# EAGLE design ENGI301 (EAGLE 9.7.0)
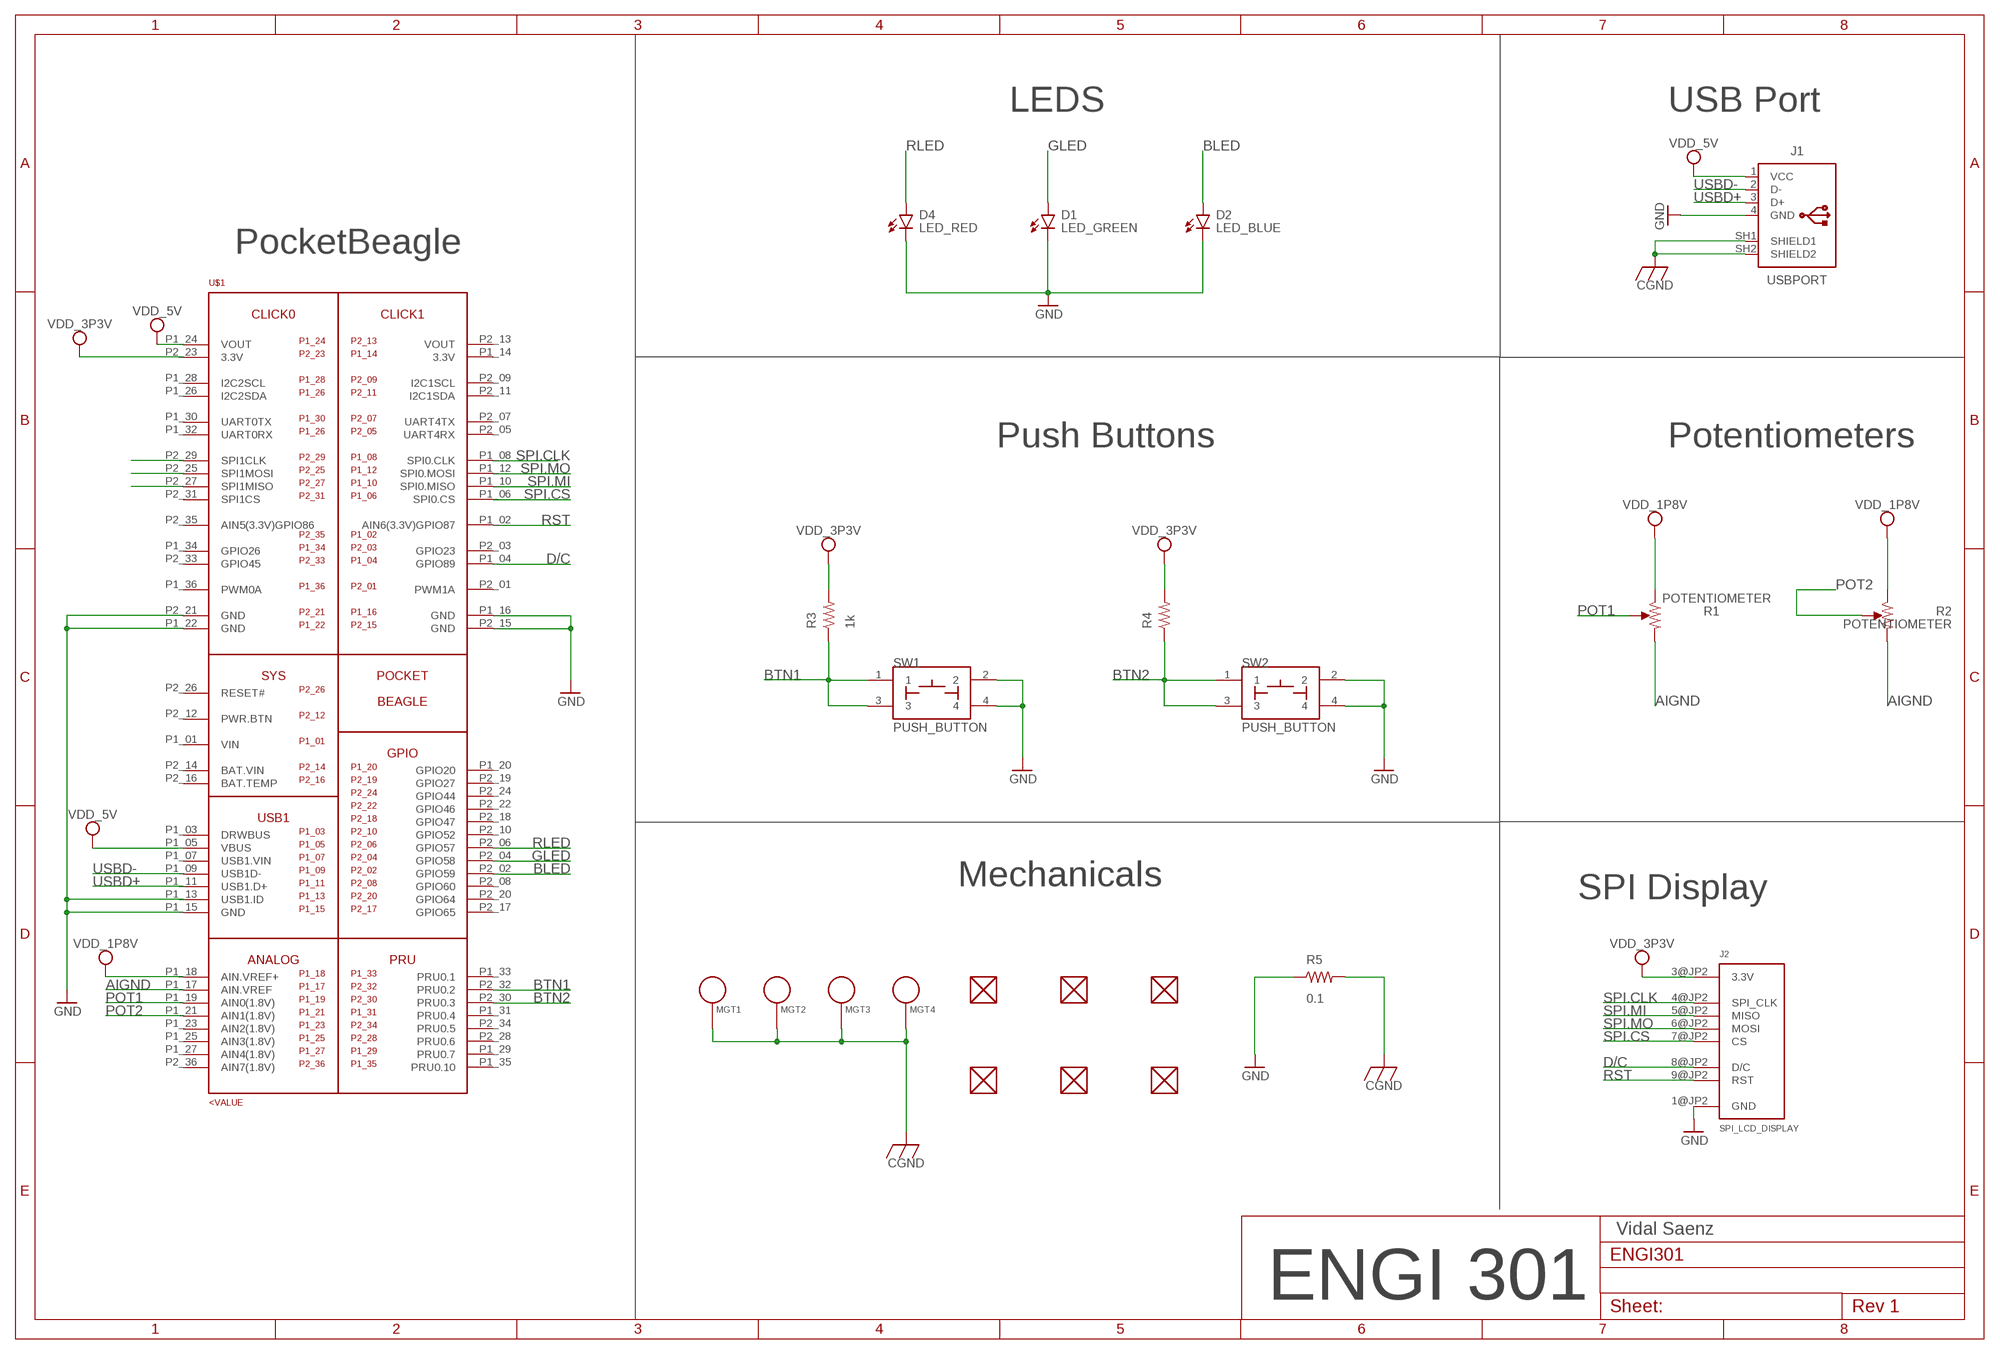
[diagram p0: schematic, sheet 1]

## Parts
D1  LED_GREEN  LED_G_1206  [LEDC3216X75N_FLAT-G]
D2  LED_BLUE  LED_B_1206  [LEDC3216X75N_FLAT-B]
D4  LED_RED  LED_R_1206  [LEDC3216X75N_FLAT-R]
FUD1  FIDUCIAL  [FIDUCIAL_40MIL]
FUD2  FIDUCIAL  [FIDUCIAL_40MIL]
FUD3  FIDUCIAL  [FIDUCIAL_40MIL]
FUD4  FIDUCIAL  [FIDUCIAL_40MIL]
FUD5  FIDUCIAL  [FIDUCIAL_40MIL]
FUD6  FIDUCIAL  [FIDUCIAL_40MIL]
J1  USBPORT  [1734366]
J2  SPI_LCD_DISPLAY  [SPI_LCD_DISPLAY]
MGT1  MOUNTING_HOLE  [MOUNTING_HOLE]
MGT2  MOUNTING_HOLE  [MOUNTING_HOLE]
MGT3  MOUNTING_HOLE  [MOUNTING_HOLE]
MGT4  MOUNTING_HOLE  [MOUNTING_HOLE]
R1  POTENTIOMETER  [POT-PO90S]
R2  POTENTIOMETER  [POT-PO90S]
R3  1k  R_R1206  [R1206]
R4  R_R1206  [R1206]
R5  0.1  R_R0603  [R0603]
SW1  PUSH_BUTTON  [BUTTON_12.5MM]
SW2  PUSH_BUTTON  [BUTTON_12.5MM]
U$1  POCKETBEAGLE  [POCKETBEAGLE]

## Nets
AIGND: R1.CW R2.CW U$1.P1_17(AIN.VREF)
BLED: D2.A U$1.P2_02(GPIO59)
BTN1: R3.1 SW1.1 SW1.3 U$1.P2_32(PRU0.2)
BTN2: R4.1 SW2.1 SW2.3 U$1.P2_30(PRU0.3)
CGND: MGT1.P$1 MGT2.P$1 MGT3.P$1 MGT4.P$1 R5.2
D/C: J2.8@JP2(D/C) U$1.P1_04(GPIO89)
GLED: D1.A U$1.P2_04(GPIO58)
GND: J1.4(GND) J2.1@JP2(GND) R5.1 SW1.2 SW1.4 SW2.2 SW2.4 U$1.P1_13(USB1.ID) U$1.P1_15(GND) U$1.P1_16(GND) U$1.P1_22(GND) U$1.P2_15(GND) U$1.P2_21(GND)
N$1: D1.C D2.C D4.C ; supply symbol labelled GND
N$2: U$1.P2_29(SPI1CLK)
N$3: U$1.P2_25(SPI1MOSI)
N$4: U$1.P2_27(SPI1MISO)
POT1: R1.S U$1.P1_19(AIN0(1.8V))
POT2: R2.S U$1.P1_21(AIN1(1.8V))
RLED: D4.A U$1.P2_06(GPIO57)
RST: J2.9@JP2(RST) U$1.P1_02(AIN6(3.3V)GPIO87)
SHIELD2: J1.SH1(SHIELD1) J1.SH2(SHIELD2) ; supply symbol labelled CGND
SPI.CLK: J2.4@JP2(SPI_CLK) U$1.P1_08(SPI0.CLK)
SPI.CS: J2.7@JP2(CS) U$1.P1_06(SPI0.CS)
SPI.MI: J2.5@JP2(MISO) U$1.P1_10(SPI0.MISO)
SPI.MO: J2.6@JP2(MOSI) U$1.P1_12(SPI0.MOSI)
USBD+: J1.3(D+) U$1.P1_11(USB1.D+)
USBD-: J1.2(D-) U$1.P1_09(USB1D-)
VDD_1P8V: R1.CCW R2.CCW U$1.P1_18(AIN.VREF+)
VDD_3P3V: J2.3@JP2(3.3V) R3.2 R4.2 U$1.P2_23(3.3V)
VDD_5V: J1.1(VCC) U$1.P1_05(VBUS) U$1.P1_24(VOUT)
Unconnected: FUD1.P$1 FUD2.P$1 FUD3.P$1 FUD4.P$1 FUD5.P$1 FUD6.P$1 U$1.P1_01(VIN) U$1.P1_03(DRWBUS) U$1.P1_07(USB1.VIN) U$1.P1_14(3.3V) U$1.P1_20(GPIO20) U$1.P1_23(AIN2(1.8V)) U$1.P1_25(AIN3(1.8V)) U$1.P1_26(I2C2SDA) U$1.P1_27(AIN4(1.8V)) U$1.P1_28(I2C2SCL) U$1.P1_29(PRU0.7) U$1.P1_30(UART0TX) U$1.P1_31(PRU0.4) U$1.P1_32(UART0RX) U$1.P1_33(PRU0.1) U$1.P1_34(GPIO26) U$1.P1_35(PRU0.10) U$1.P1_36(PWM0A) U$1.P2_01(PWM1A) U$1.P2_03(GPIO23) U$1.P2_05(UART4RX) U$1.P2_07(UART4TX) U$1.P2_08(GPIO60) U$1.P2_09(I2C1SCL) U$1.P2_10(GPIO52) U$1.P2_11(I2C1SDA) U$1.P2_12(PWR.BTN) U$1.P2_13(VOUT) U$1.P2_14(BAT.VIN) U$1.P2_16(BAT.TEMP) U$1.P2_17(GPIO65) U$1.P2_18(GPIO47) U$1.P2_19(GPIO27) U$1.P2_20(GPIO64) U$1.P2_22(GPIO46) U$1.P2_24(GPIO44) U$1.P2_26(RESET#) U$1.P2_28(PRU0.6) U$1.P2_31(SPI1CS) U$1.P2_33(GPIO45) U$1.P2_34(PRU0.5) U$1.P2_35(AIN5(3.3V)GPIO86) U$1.P2_36(AIN7(1.8V))

## Notes on the sheet
- LEDS | USB Port
- PocketBeagle
- Push Buttons | Potentiometers
- Mechanicals
- SPI Display
- Vidal Saenz
- ENGI 301

## Library data of the parts
D1 = ENGI301:LED_G; CATEGORY: LED; COLOR: GREEN; DESCRIPTION: CHIP LED FLAT; SUB-CATEGORY: CHIP; TYPE: FLAT_TOP
D2 = ENGI301:LED_B; CATEGORY: LED; COLOR: BLUE; DESCRIPTION: CHIP LED FLAT; SUB-CATEGORY: CHIP; TYPE: FLAT_TOP
D4 = ENGI301:LED_R; CATEGORY: LED; COLOR: RED; DESCRIPTION: CHIP LED FLAT; SUB-CATEGORY: CHIP; TYPE: FLAT_TOP
FUD1-FUD6 = Etch_a_Sketch:FIDUCIAL
J1 = ENGI301:USBPORT: USB(2.0) Type-A, RCPT, 4POS, THT-VERT Datasheet <https://www.te.com/commerce/DocumentDelivery/DDEController?Action=showdoc&DocId=Data+Sheet%7F7-1773442-0%7F0306%7Fpdf%7FEnglish%7FENG_DS_7-1773442-0_0306.pdf%7F1734366-1> Drawing <https://www.te.com/commerce/DocumentDelivery/DDEController?Action=srchrtrv&DocNm=1734366&DocType=Customer+Drawing&DocLang=English>; CATEGORY: Connector; CONTACTS: 4; CURRENT_RATING: 1A; DESCRIPTION: CONN RCPT USB2.0 TYPEA 4POS VERT; GENDER: Receptacle; MANUFACTURER: TE Connectivity; MOUNT_TYPE: Vertical; MPN: 1734366-1; OPERATING_TEMP: -40° to +80°C; PART_STATUS: Active; ROHS_COMPLIANT: RoHS Compliant; SERIES: -; SUB-CATEGORY: USB; TYPE: USB-A; VOLTAGE_RATING: 30VAC(rms)
J2 = ENGI301:SPI_LCD_DISPLAY: 2.8" Adafruit SPI Display
MGT1-MGT4 = Etch_a_Sketch:MOUNTING_HOLE: Chassis Mounting Hole w/GND connection ability
R1 R2 = ENGI301:POTENTIOMETER: Potentiometer - Examples: P090S-14T20BR10K (987-1277-ND)
R3-R5 = Etch_a_Sketch:R_: RESISTOR, American symbol
SW1 SW2 = ENGI301:PUSH_BUTTON
U$1 = ENGI301:POCKETBEAGLE

## Board
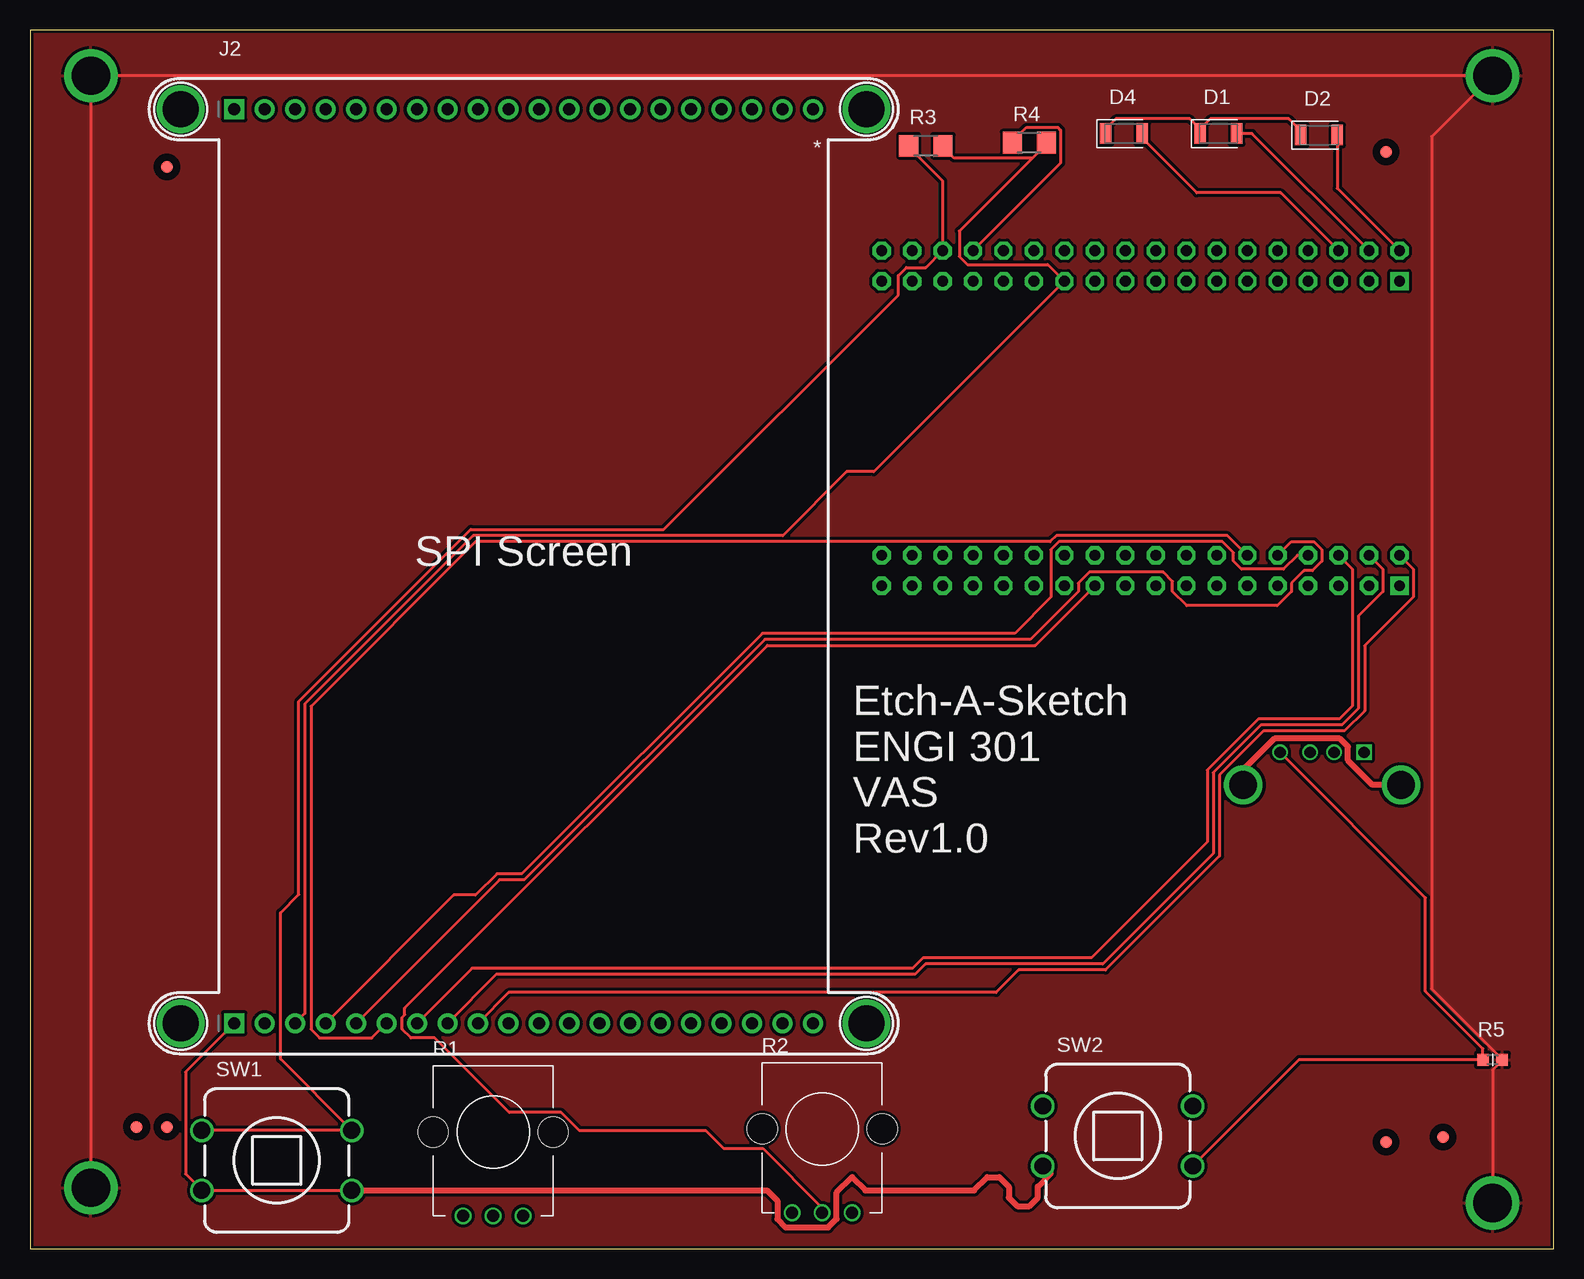
[diagram p1: board, top side]
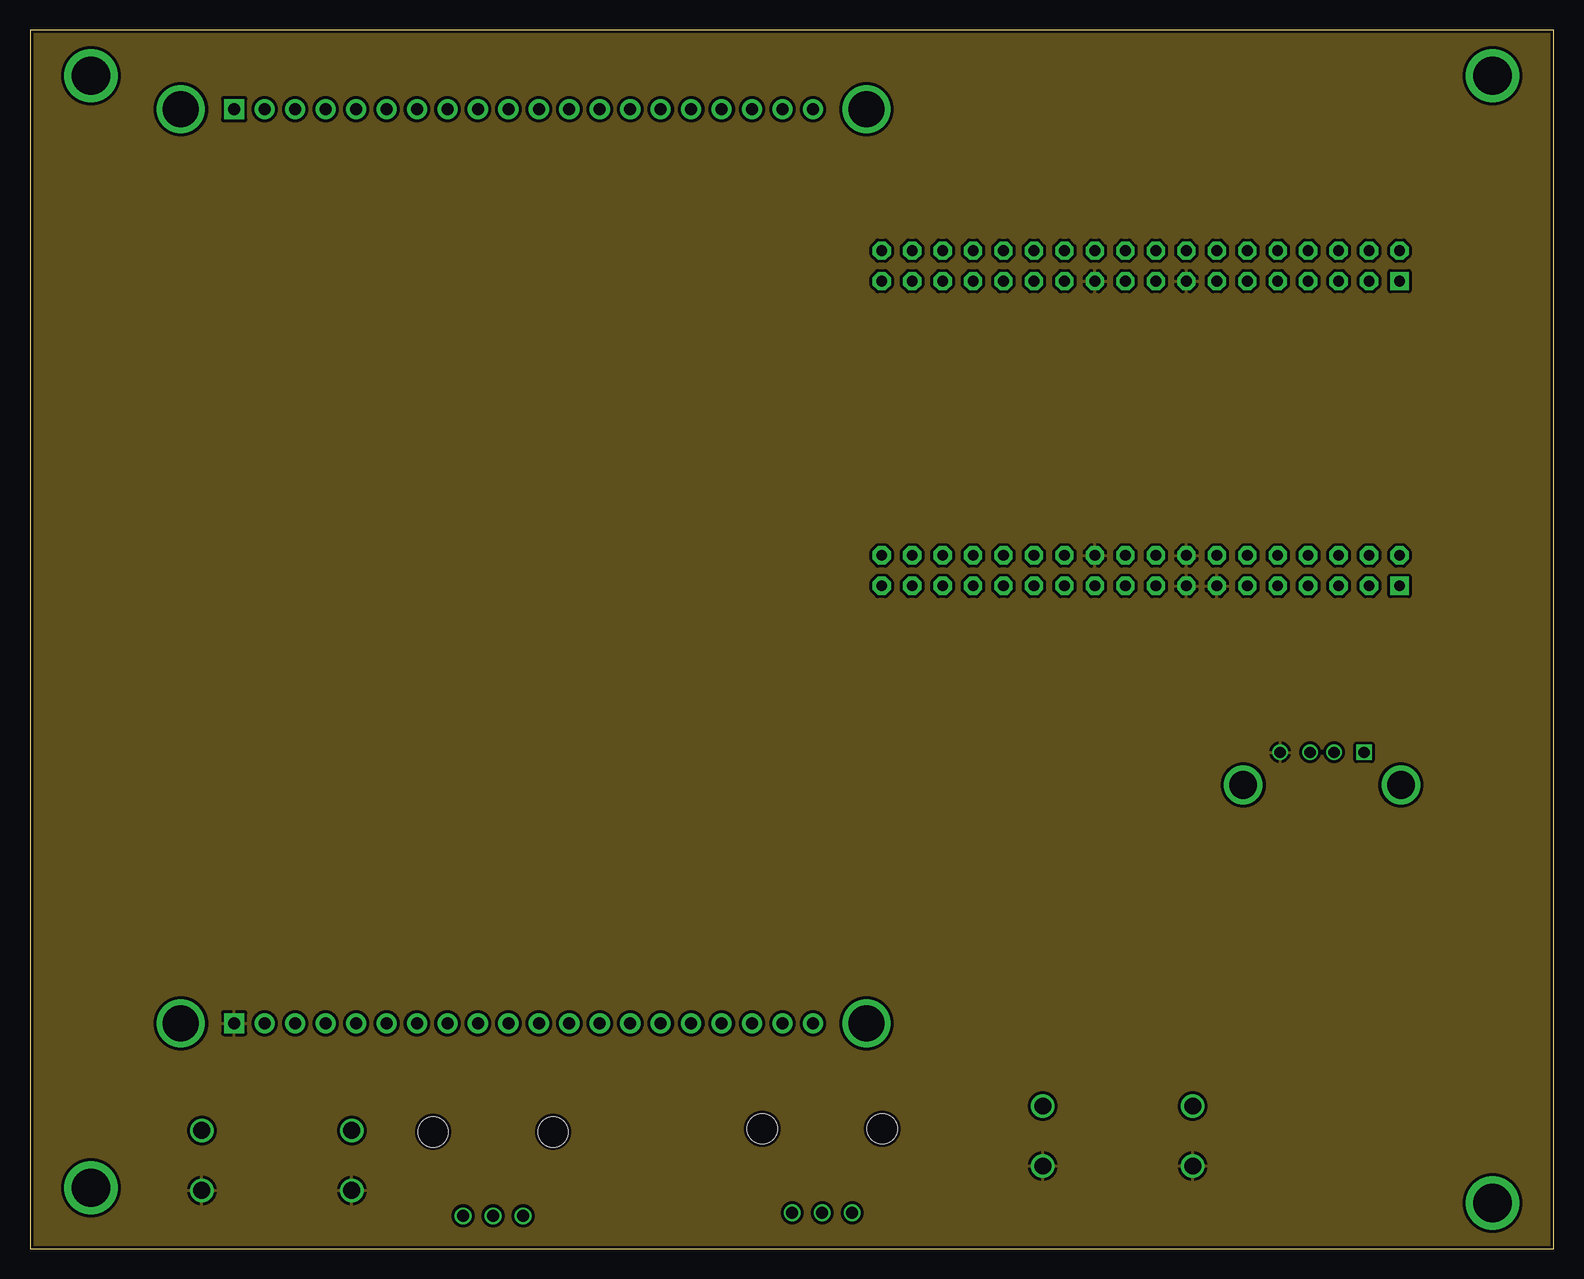
[diagram p2: board, inner layer Route2]
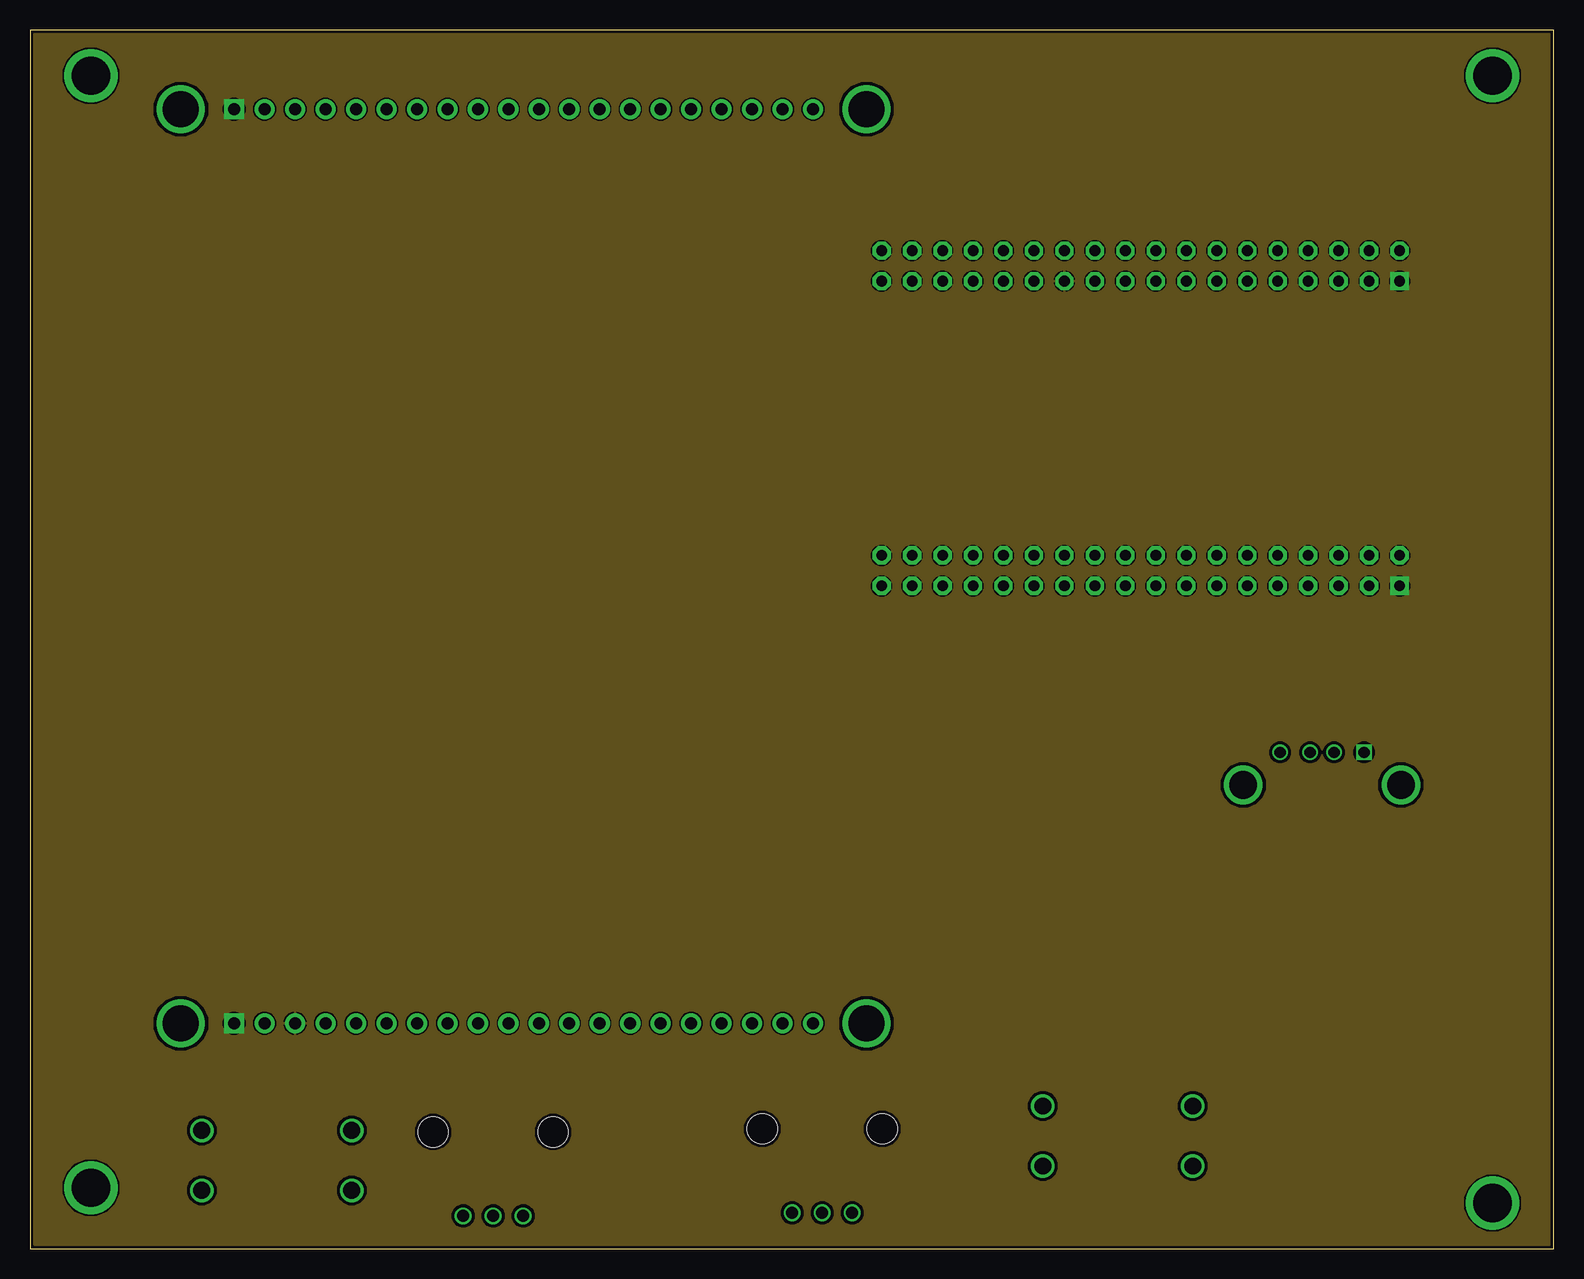
[diagram p3: board, inner layer Route15]
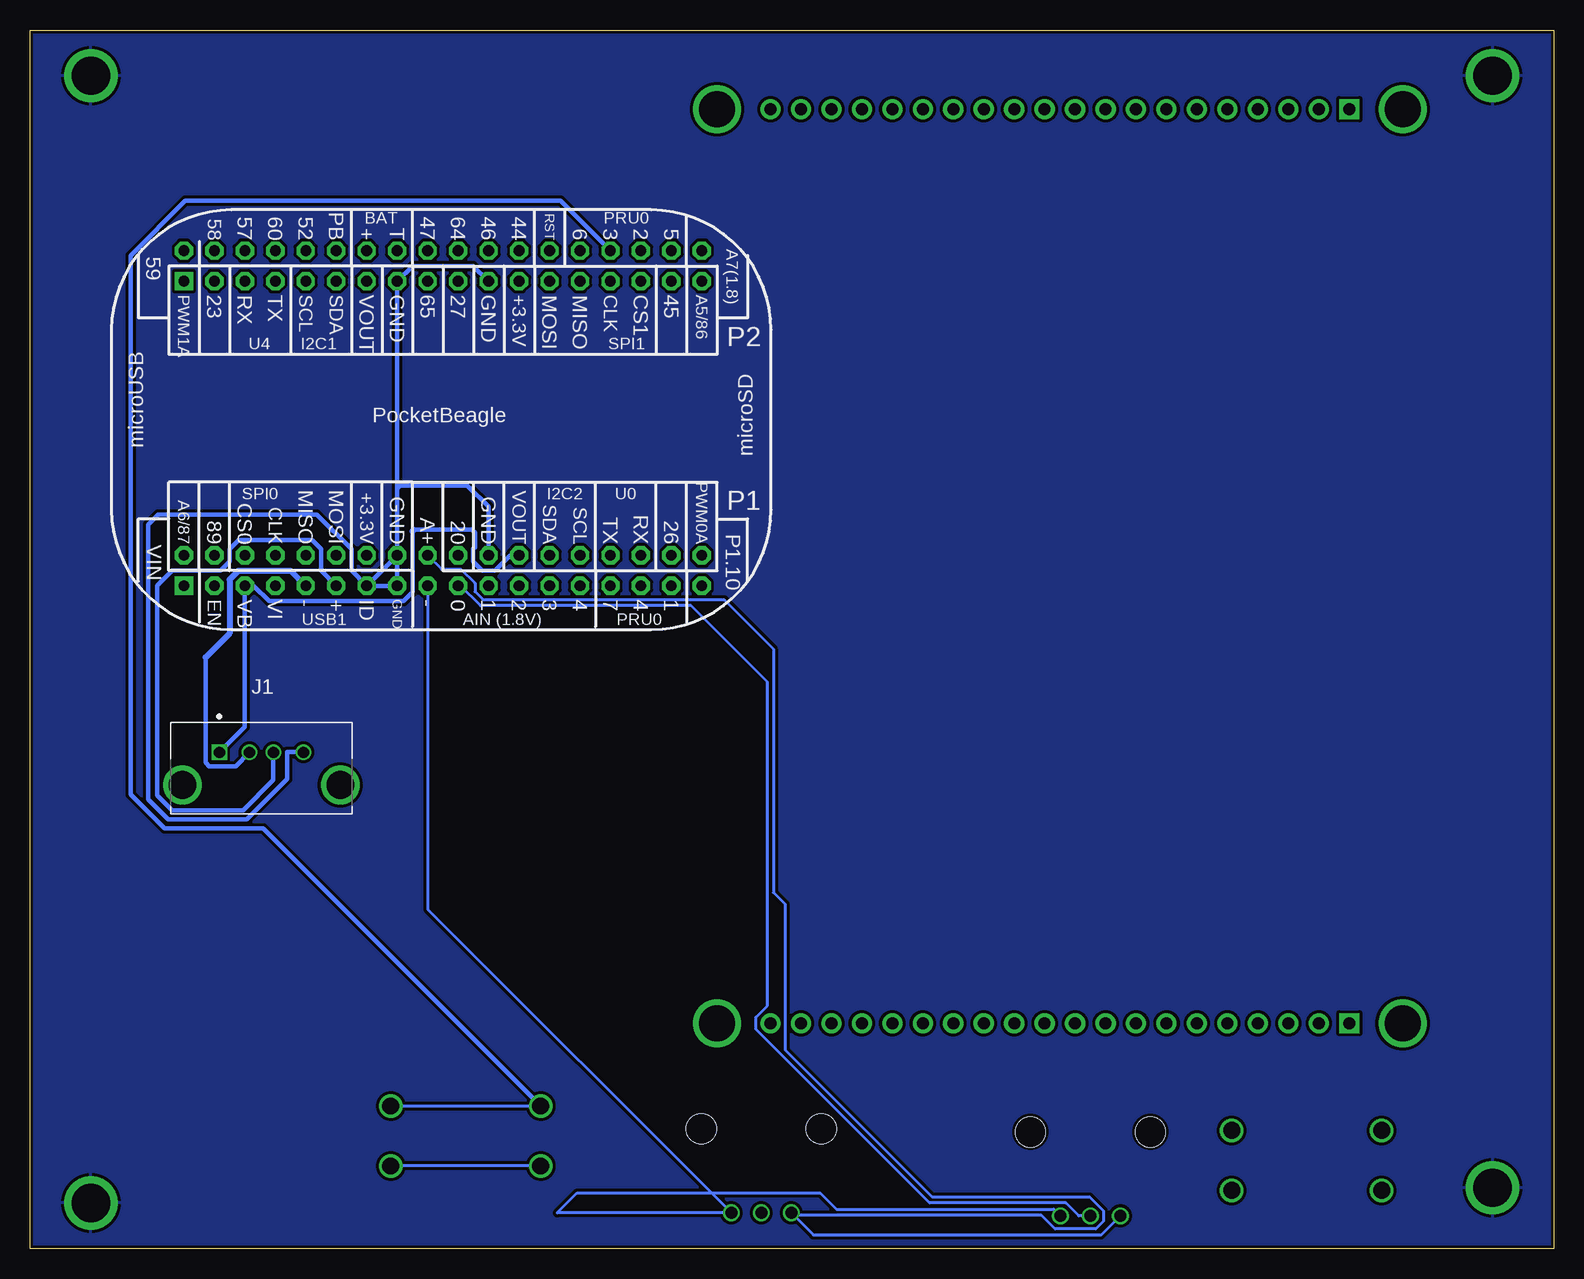
[diagram p4: board, bottom side, seen from below]

Size 127 x 101.6 mm. Coordinates in mm from the lower left corner, seen from the top.
Outline: 0,0 127,0 127,101.6 0,101.6 0,0
Copper layers (1*2*15*16): Top / Route2 / Route15 / Bottom
Stack-up Default Layer Stack: Top User Defined 0.035mm / Dielectric-2 User Defined 0.23mm / Route2 User Defined 0.035mm / Dielectric-1 User Defined 0.93mm / Route15 User Defined 0.035mm / Dielectric-3 User Defined 0.23mm / Bottom User Defined 0.035mm
Design rules: minimum copper width 10mil, minimum drill size 12mil, copper clearance wire_polygon to wire_polygon 10mil, copper clearance wire_polygon to pad_smd 10mil, copper clearance wire_polygon to via 10mil, copper clearance pad_smd to pad_smd 10mil, copper clearance pad_smd to via 10mil, copper clearance via to via 10mil, copper clearance smd to pad (same net) 10mil, copper clearance smd to via (same net) 10mil, copper clearance smd to smd (same net) 10mil, dimension clearance 10mil, drill distance 12mil, keepout clearance 0mil

### Footprints (pad centres in the part's own frame; a part is rotated, then mirrored left to right if it is on the bottom)
LEDC3216X75N_FLAT-G = smd 0.962 x 1.712: A 1.525,0; C -1.525,0
LEDC3216X75N_FLAT-B = smd 0.962 x 1.712: A 1.525,0; C -1.525,0
LEDC3216X75N_FLAT-R = smd 0.962 x 1.712: A 1.525,0; C -1.525,0
FIDUCIAL_40MIL = smd 1.016 x 1.016: P$1 0,0
1734366 = drill 0.92 square: 1 0,0 | drill 0.92: 2 2.5,0; 3 4.5,0; 4 7,0 | drill 2.3: SH1 -3.07,-2.71; SH2 10.07,-2.71
SPI_LCD_DISPLAY = drill 1 pad 1.676 square: 1@JP1 -24.13,38.1; 1@JP2 -24.13,-38.1 | drill 1 pad 1.676: 2@JP1 -21.59,38.1; 2@JP2 -21.59,-38.1; 3@JP1 -19.05,38.1; 3@JP2 -19.05,-38.1; 4@JP1 -16.51,38.1; 4@JP2 -16.51,-38.1; 5@JP1 -13.97,38.1; 5@JP2 -13.97,-38.1; 6@JP1 -11.43,38.1; 6@JP2 -11.43,-38.1; 7@JP1 -8.89,38.1; 7@JP2 -8.89,-38.1; 8@JP1 -6.35,38.1; 8@JP2 -6.35,-38.1; 9@JP1 -3.81,38.1; 9@JP2 -3.81,-38.1; 10@JP1 -1.27,38.1; 10@JP2 -1.27,-38.1; 11@JP1 1.27,38.1; 11@JP2 1.27,-38.1; 12@JP1 3.81,38.1; 12@JP2 3.81,-38.1; 13@JP1 6.35,38.1; 13@JP2 6.35,-38.1; 14@JP1 8.89,38.1; 14@JP2 8.89,-38.1; 15@JP1 11.43,38.1; 15@JP2 11.43,-38.1; 16@JP1 13.97,38.1; 16@JP2 13.97,-38.1; 17@JP1 16.51,38.1; 17@JP2 16.51,-38.1; 18@JP1 19.05,38.1; 18@JP2 19.05,-38.1; 19@JP1 21.59,38.1; 19@JP2 21.59,-38.1; 20@JP1 24.13,38.1; 20@JP2 24.13,-38.1 | drill 3 pad 3.6: P$1@U$7 -28.575,-38.1; P$1@U$15 28.575,-38.1; P$1@U$16 -28.575,38.1; P$1@U$17 28.575,38.1
MOUNTING_HOLE = drill 3.175 pad 4.445: P$1 0,0
POT-PO90S = drill 1: CCW -2.5,0; CW 2.5,0; S 0,0 | hole 2.5: -5,7; 5,7
R1206 = smd 1.6 x 1.803: 1 -1.422,0; 2 1.422,0
R0603 = smd 0.95 x 1.031: 1 -0.8,0; 2 0.8,0
BUTTON_12.5MM = drill 1.4: 1 -6.25,2.5; 2 -6.25,-2.5; 3 6.25,2.5; 4 6.25,-2.5
POCKETBEAGLE = drill 0.889 pad 1.524 square: P1_01 5.91,3.53; P2_01 5.91,28.93 | drill 0.889 pad 1.524 octagon: P1_02 5.91,6.07; P1_03 8.45,3.53; P1_04 8.45,6.07; P1_05 10.99,3.53; P1_06 10.99,6.07; P1_07 13.53,3.53; P1_08 13.53,6.07; P1_09 16.07,3.53; P1_10 16.07,6.07; P1_11 18.61,3.53; P1_12 18.61,6.07; P1_13 21.15,3.53; P1_14 21.15,6.07; P1_15 23.69,3.53; P1_16 23.69,6.07; P1_17 26.23,3.53; P1_18 26.23,6.07; P1_19 28.77,3.53; P1_20 28.77,6.07; P1_21 31.31,3.53; P1_22 31.31,6.07; P1_23 33.85,3.53; P1_24 33.85,6.07; P1_25 36.39,3.53; P1_26 36.39,6.07; P1_27 38.93,3.53; P1_28 38.93,6.07; P1_29 41.47,3.53; P1_30 41.47,6.07; P1_31 44.01,3.53; P1_32 44.01,6.07; P1_33 46.55,3.53; P1_34 46.55,6.07; P1_35 49.09,3.53; P1_36 49.09,6.07; P2_02 5.91,31.47; P2_03 8.45,28.93; P2_04 8.45,31.47; P2_05 10.99,28.93; P2_06 10.99,31.47; P2_07 13.53,28.93; P2_08 13.53,31.47; P2_09 16.07,28.93; P2_10 16.07,31.47; P2_11 18.61,28.93; P2_12 18.61,31.47; P2_13 21.15,28.93; P2_14 21.15,31.47; P2_15 23.69,28.93; P2_16 23.69,31.47; P2_17 26.23,28.93; P2_18 26.23,31.47; P2_19 28.77,28.93; P2_20 28.77,31.47; P2_21 31.31,28.93; P2_22 31.31,31.47; P2_23 33.85,28.93; P2_24 33.85,31.47; P2_25 36.39,28.93; P2_26 36.39,31.47; P2_27 38.93,28.93; P2_28 38.93,31.47; P2_29 41.47,28.93; P2_30 41.47,31.47; P2_31 44.01,28.93; P2_32 44.01,31.47; P2_33 46.55,28.93; P2_34 46.55,31.47; P2_35 49.09,28.93; P2_36 49.09,31.47

### Placement (x,y rotation side)
D1  99.06,92.96 0 top
D2  107.44,92.84 0 top
D4  91.19,92.96 0 top
FUD1  117.8,9.3 0 top
FUD2  8.89,10.16 0 top
FUD3  11.43,90.17 0 top
FUD4  113.03,8.89 0 top
FUD5  11.43,10.16 0 top
FUD6  113.03,91.44 0 top
J1  111.21,41.38 0 bottom
J2  41.15,56.9 0 top
MGT1  5.08,5.08 0 top
MGT2  5.08,97.79 0 top
MGT3  121.92,97.79 0 top
MGT4  121.92,3.81 0 top
R1  38.61,2.73 0 top
R2  66.04,2.99 0 top
R3  74.68,91.95 0 top
R4  83.31,92.2 0 top
R5  121.92,15.75 0 top
SW1  20.57,7.37 0 top
SW2  90.68,9.4 0 top
U$1  120.08,51.73 0 bottom

### Tracks (layer width: path | path; a pad name or v marks a point on that pad's centre or on a via)
AIGND
  Bottom 0.254: R1.CW 41.68,3.31 59.79,3.31 61.14,4.65 81.39,4.65 83.05,2.99 R2.CW 93.85,28.3 U$1.P1_17
BLED
  Top 0.254: D2.A 108.97,88.4 U$1.P2_02
BTN1
  Top 0.254: SW1.1 SW1.3 20.88,15.81 20.88,28 22.4,29.53 22.4,45.63 36.73,59.96 52.83,59.96 72.39,79.51 72.39,81.13 73.06,81.8 74.68,81.8 U$1.P2_32 76.07,89.03 73.25,91.85 R3.1
BTN2
  Top 0.254: R4.1 81.89,92.3 83.07,93.48 85.69,93.48 85.92,93.26 85.92,90.5 U$1.P2_30
  Bottom 0.254: SW2.3 SW2.1
  Bottom 0.381: U$1.P2_30 82.79,87.38 114.05,87.38 118.62,82.8 118.62,37.85 115.79,35.02 107.55,35.02 SW2.1
CGND
  Top 0.254: MGT4.P$1 121.92,14.91 122.72,15.71 R5.2 122.72,15.79 116.84,21.67 116.84,92.71 MGT3.P$1 MGT2.P$1 MGT1.P$1
  pour Top: -1.27,102.87 -1.27,-1.27 128.27,-1.27 128.27,102.87
  pour Top: -1.27,50.8 2.54,50.8 2.54,93.98 8.89,93.98 8.89,100.33 118.11,100.33 118.11,93.98 124.46,93.98 124.46,7.62 118.11,7.62 118.11,1.27 2.54,1.27 2.54,50.8
  pour Top: 128.27,50.8 124.46,50.8 124.46,93.98 118.11,93.98 118.11,100.33 8.89,100.33 8.89,93.98 2.54,93.98 2.54,1.27 118.11,1.27 118.11,7.62 124.46,7.62 124.46,50.8
  pour Bottom: -1.27,102.87 -1.27,-1.27 128.27,-1.27 128.27,102.87
  pour Bottom: -1.27,50.8 2.54,50.8 2.54,1.27 118.11,1.27 118.11,7.62 124.46,7.62 124.46,93.98 118.11,93.98 118.11,100.33 8.89,100.33 8.89,93.98 2.54,93.98 2.54,50.8
  pour Bottom: 128.27,50.8 124.46,50.8 124.46,7.62 118.11,7.62 118.11,0 2.54,0 2.54,93.98 8.89,93.98 8.89,100.33 118.11,100.33 118.11,93.98 124.46,93.98 124.46,50.8
D/C
  Top 0.254: U$1.P1_04 112.78,56.65 112.78,54.78 110.74,52.75 110.74,45.05 109.37,43.67 102.61,43.67 98.64,39.7 98.64,32.95 89.44,23.74 74.65,23.74 73.78,22.87 38.88,22.87 J2.8@JP2
GLED
  Top 0.254: U$1.P2_04 101.87,92.96 D1.A
GND
  Top 0.254: SW1.4 SW1.2 12.96,6.23 12.96,14.74 J2.1@JP2 | SW2.4 105.78,15.75 R5.1 121.12,16.67 116.33,21.46 116.33,29.25 J1.4
  Top 0.508: SW2.2 85.08,6.25 84.01,5.18 84.01,4.26 83.3,3.56 82.3,3.56 81.6,4.26 81.6,5.18 80.8,5.97 79.8,5.97 78.7,4.87 69.64,4.87 68.53,5.97 67.25,4.69 67.25,2.49 66.54,1.78 63,1.78 62.29,2.49 62.29,4 61.43,4.87 SW1.4
  Bottom 0.254: SW2.2 SW2.4
  Bottom 0.381: U$1.P2_21 90.04,81.93 95.12,81.93 U$1.P2_15 U$1.P1_16 | U$1.P1_13 U$1.P1_15 U$1.P1_16 | U$1.P1_16 96.39,63.39 96.14,63.64 90.55,63.64 88.77,61.86 U$1.P1_22 | U$1.P1_16 U$1.P1_13 | 104.23,41.4 105.56,41.4 105.56,39.16 108.93,35.79 115.47,35.79 117.16,37.47 117.16,60.39 116.33,61.21 103.09,61.21 100.2,58.32 100.2,56.53 U$1.P1_13
  Bottom 0.508: 104.23,41.4 J1.4
  pour Route2: -2.54,-2.54 129.54,-2.54 129.54,104.14 -2.54,104.14
N$1
  Top 0.254: D2.C 105.92,93.21 104.93,94.2 98.4,94.2 97.53,93.34 | 97.53,93.34 D1.C 97.53,93.34 | 97.53,93.34 96.67,94.2 90.52,94.2 89.66,93.34 D4.C
POT1
  Bottom 0.254: R1.S 39.58,2.73 40.66,3.81 52.02,3.81 66.5,18.29 66.5,19.3 65.53,20.27 65.53,47.26 71.88,53.61 89.46,53.61 91.11,55.26 U$1.P1_19
POT2
  Top 0.254: U$1.P1_21 83.81,50.29 61.47,50.29 31.24,20.07 31.24,19.5 31.04,19.3 31.04,18.29 31.75,17.58 33.73,17.58 39.95,11.36 44.28,11.36 45.8,9.84 56.34,9.84 57.82,8.36 61.09,8.36 66.04,3.4 R2.S
RLED
  Top 0.254: U$1.P2_06 104.26,88.03 97.27,88.03 92.71,92.59 D4.A
RST
  Top 0.254: U$1.P1_02 115.32,56.65 115.32,54.34 111.25,50.27 111.25,44.84 109.58,43.16 102.82,43.16 99.15,39.49 99.15,32.73 89.65,23.23 82.4,23.23 80.54,21.37 39.91,21.37 J2.9@JP2
SHIELD2
  Top 0.508: J1.SH1 111.91,38.67 109.86,40.72 109.86,41.85 109.19,42.53 103.73,42.53 101.14,39.94 J1.SH2
SPI.CLK
  Top 0.254: J2.4@JP2 35.32,29.48 37.14,29.48 38.92,31.25 40.99,31.25 61.05,51.31 82.09,51.31 85.09,54.31 85.09,58.27 85.76,58.94 99.41,58.94 100.33,58.02 100.33,57.32 101,56.65 104.49,56.65 105.63,57.8 U$1.P1_08
SPI.CS
  Top 0.254: U$1.P1_06 110.24,56.65 110.24,45.26 109.16,44.18 102.4,44.18 98.13,39.91 98.13,33.9 88.48,24.25 74.44,24.25 73.57,23.38 36.84,23.38 J2.7@JP2
SPI.MI
  Top 0.254: U$1.P1_10 105.16,58.94 107.03,58.94 107.7,58.27 107.7,57.32 106.9,56.53 106.21,56.53 105.16,55.48 105.16,54.78 103.98,53.61 96.43,53.61 95.25,54.78 95.25,55.63 94.47,56.4 88.3,56.4 87.38,55.48 87.38,54.78 83.39,50.8 61.26,50.8 41.2,30.75 39.13,30.75 J2.5@JP2
SPI.MO
  Top 0.254: J2.6@JP2 28.5,17.58 24.13,17.58 23.42,18.29 23.42,45.21 37.15,58.94 85.04,58.94 85.55,59.45 99.82,59.45 U$1.P1_12
USBD+
  Bottom 0.381: U$1.P1_11 102.74,56.53 102.74,58.32 103.49,59.07 109.62,59.07 110.36,58.32 110.36,57.27 111.11,56.53 115.14,56.53 116.4,55.28 116.4,37.79 115.16,36.55 109.25,36.55 106.71,39.09 J1.3
USBD-
  Bottom 0.381: 112.36,49.29 112.36,40.52 112.06,40.22 109.86,40.22 J1.2
  Bottom 0.508: U$1.P1_09 105.28,56.53 109.62,56.53 110.36,55.78 110.36,51.29 112.36,49.29
VDD_1P8V
  Bottom 0.254: R1.CCW 37.7,1.14 61.7,1.14 R2.CCW 63.35,2.8 42.7,2.8 41.56,1.65 38.16,1.65 37.53,2.28 37.53,3.18 38.67,4.32 51.81,4.32 64.06,16.57 64.06,28.73 65.02,29.7 65.02,50.01 69.13,54.11 89.25,54.11 89.92,54.78 89.92,55.48 91.08,56.65 92.7,56.65 U$1.P1_18
VDD_3P3V
  Top 0.254: 83.55,90.92 84.73,92.1 R4.2 | 83.55,90.92 77.03,90.92 76.1,91.85 R3.2 | 83.55,90.92 77.47,84.84 77.47,82.72 78.14,82.05 84.84,82.05 U$1.P2_23 70.35,64.78 68.08,64.78 62.75,59.45 36.94,59.45 22.91,45.42 22.91,19.61 J2.3@JP2
  pour Route15 (rank 6): -5.08,-5.08 132.08,-5.08 132.08,106.68 -5.08,106.68
VDD_5V
  Bottom 0.381: J1.1 109.09,43.49 U$1.P1_05 108.35,55.26 107.08,53.99 95.87,53.99 95.12,54.73 95.12,59.82 | 95,59.94 90.17,59.94 89.92,59.69 89.92,58.45 90.04,58.32 90.04,57.27 89.3,56.53 88.25,56.53 86.98,57.8 U$1.P1_24
  Bottom 0.508: 95.12,59.82 95,59.94

### Text on the board
SilkscreenTop: Etch-A-Sketch / ENGI 301 / VAS / Rev1.0